# Altium project Project Board Test SOM AM625.PrjPcb (part 4 of 7)

## Sheet GBE1 PHY.SchDoc
size A2; DocumentNumber: 6; SheetNumber: 6; SheetTotal: 12
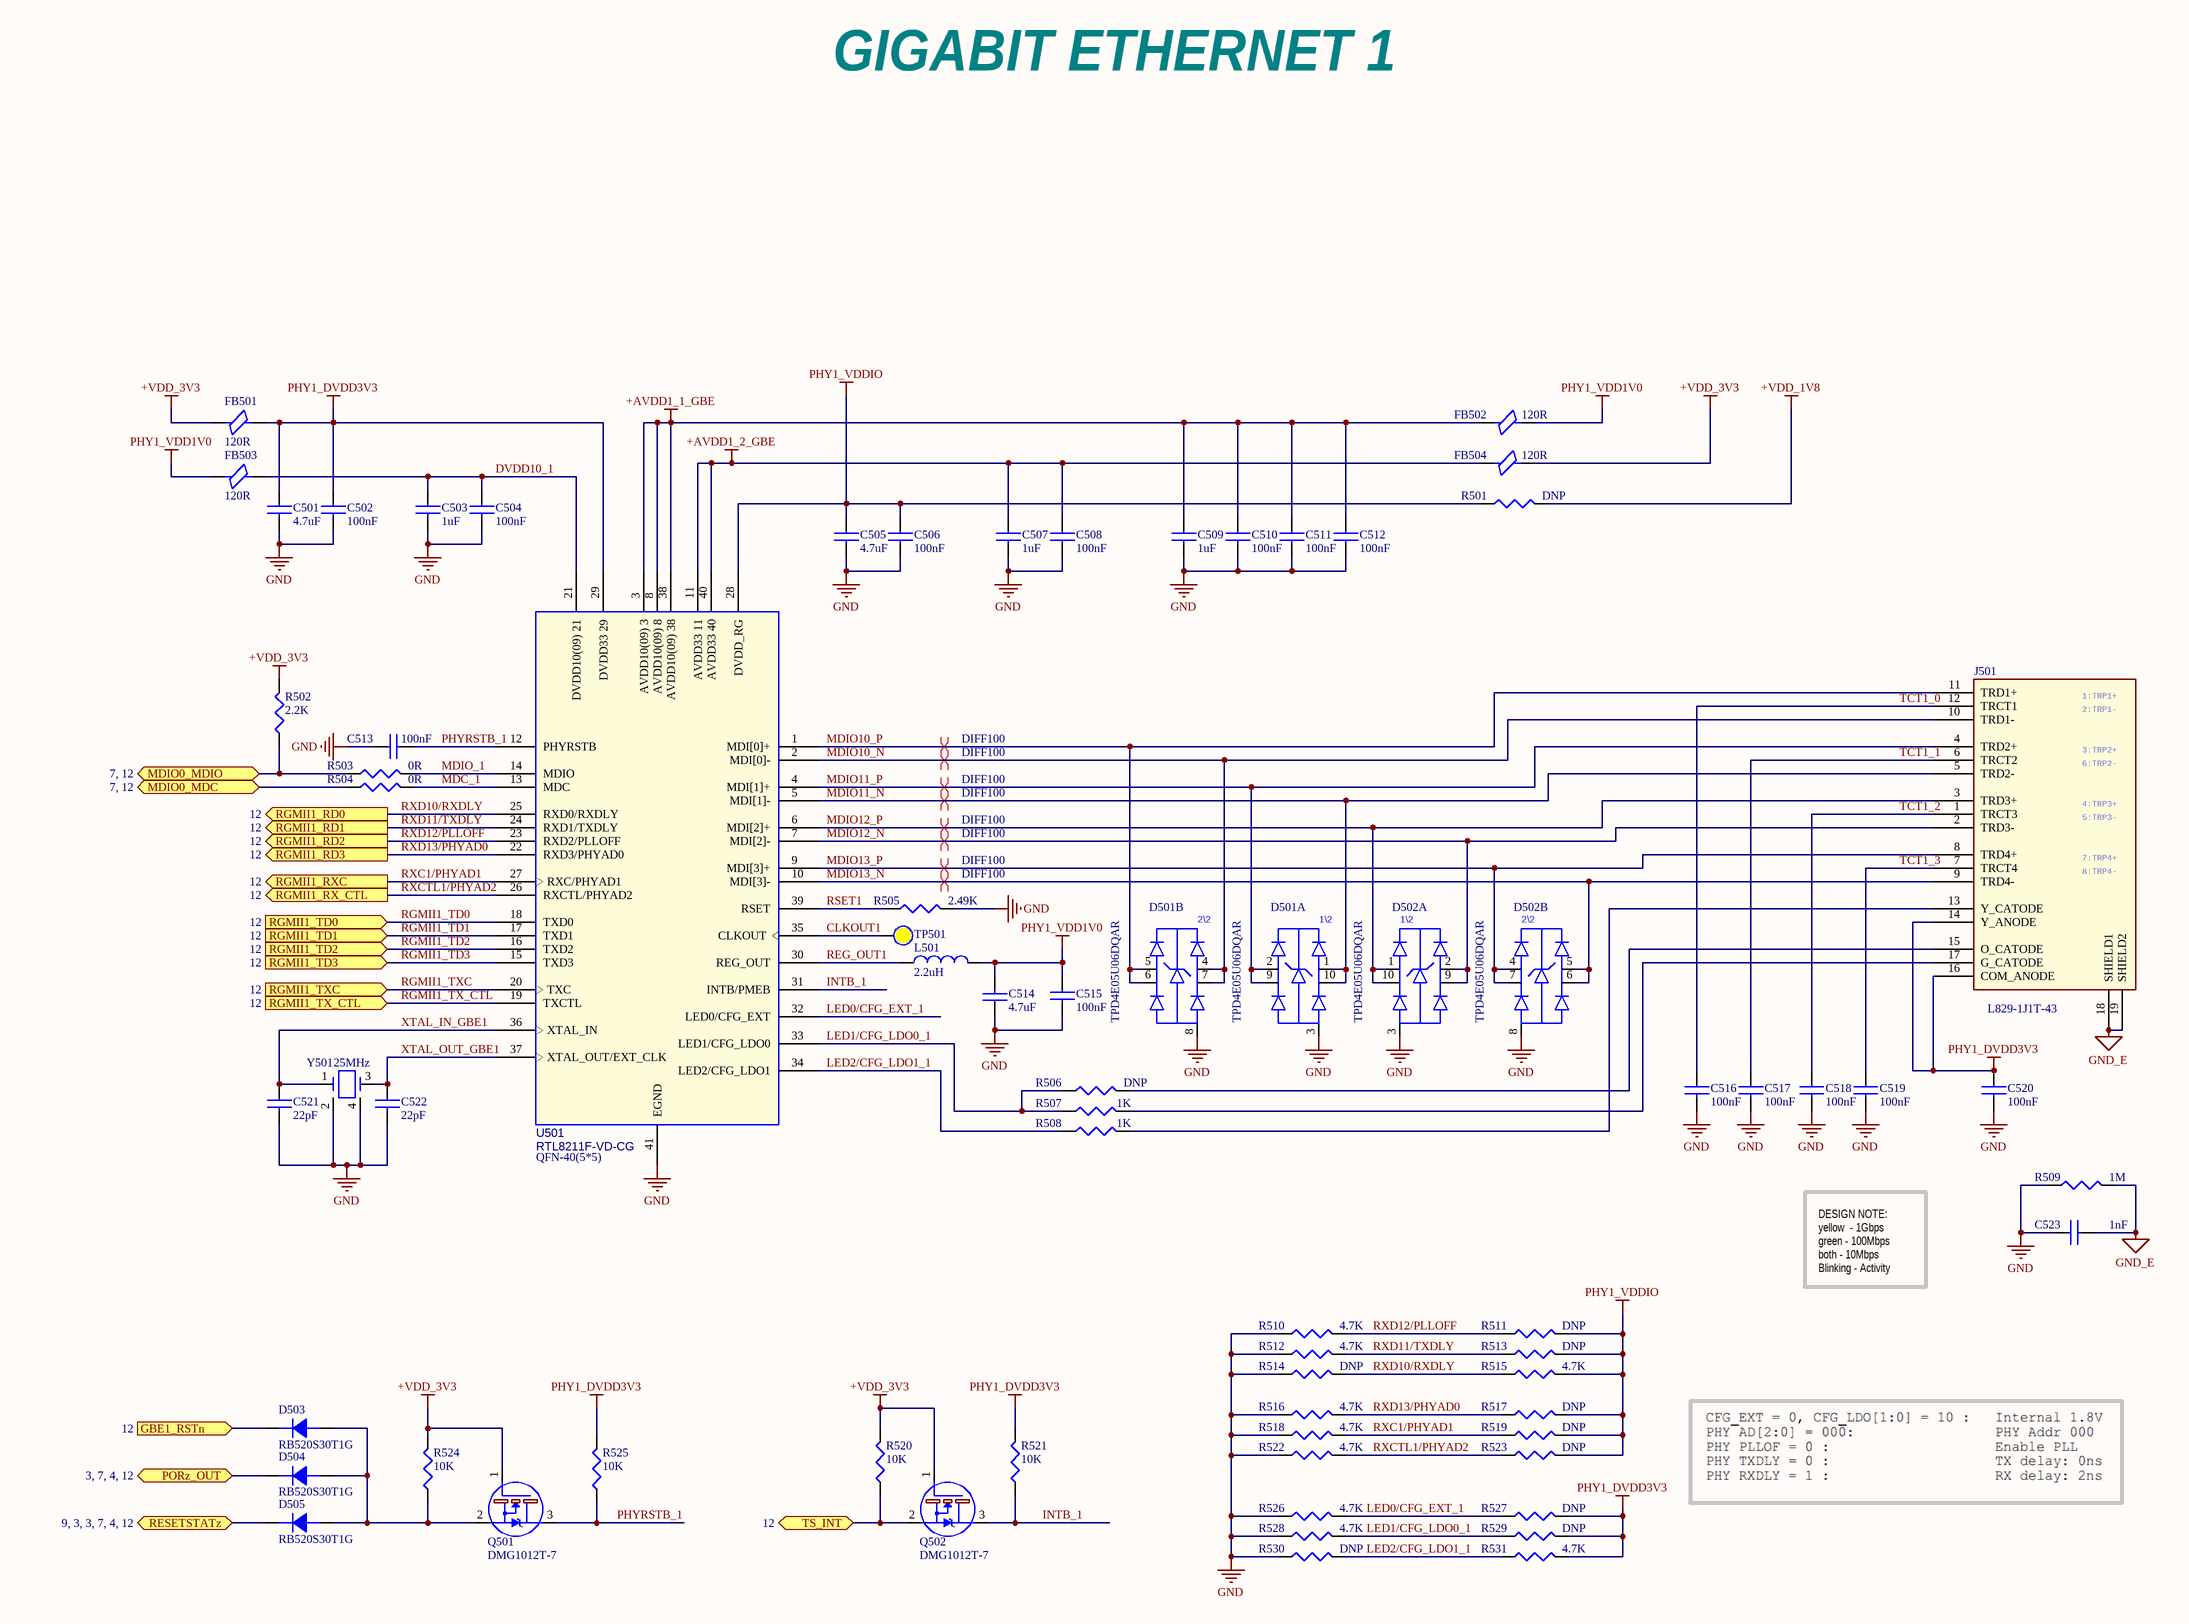
[diagram p3: GBE1 PHY.SchDoc]

### Parts
C501  4.7uF  [C0402]
C502  100nF  [C0201]
C503  1uF  [C0201]
C504  100nF  [C0201]
C505  4.7uF  [C0402]
C506  100nF  [C0201]
C507  1uF  [C0201]
C508  100nF  [C0201]
C509  1uF  [C0201]
C510  100nF  [C0201]
C511  100nF  [C0201]
C512  100nF  [C0201]
C513  100nF  [C0201]
C514  4.7uF  [C0402]
C515  100nF  [C0201]
C516  100nF  [C0402]
C517  100nF  [C0402]
C518  100nF  [C0402]
C519  100nF  [C0402]
C520  100nF  [C0402]
C521  22pF  [C0201]
C522  22pF  [C0201]
C523  1nF  [C1206B/3216MM]
D501  TPD4E05U06DQAR  [10-USON]  (parts A,B of 2)
D502  TPD4E05U06DQAR  [10-USON]  (parts A,B of 2)
D503  RB520S30T1G  [sod_523]
D504  RB520S30T1G  [sod_523]
D505  RB520S30T1G  [sod_523]
FB501  120R  [FB0402]
FB502  120R  [FB0402]
FB503  120R  [FB0402]
FB504  120R  [FB0402]
J501  L829-1J1T-43  [L829-1J1T-43]
L501  2.2uH  [l2016]
Q501  DMG1012T-7  [sot_523]
Q502  DMG1012T-7  [sot_523]
R501  DNP  [R0402]
R502  2.2K  [R0201]
R503  0R  [R0201]
R504  0R  [R0201]
R505  2.49K  [R0201]
R506  DNP  [R0402]
R507  1K  [R0402]
R508  1K  [R0402]
R509  1M  [R1206B/3216MM]
R510  4.7K  [R0201]
R511  DNP  [R0201]
R512  4.7K  [R0201]
R513  DNP  [R0201]
R514  DNP  [R0201]
R515  4.7K  [R0201]
R516  4.7K  [R0201]
R517  DNP  [R0201]
R518  4.7K  [R0201]
R519  DNP  [R0201]
R520  10K  [R0201]
R521  10K  [R0201]
R522  4.7K  [R0201]
R523  DNP  [R0201]
R524  10K  [R0201]
R525  10K  [R0201]
R526  4.7K  [R0201]
R527  DNP  [R0201]
R528  4.7K  [R0201]
R529  DNP  [R0201]
R530  DNP  [R0201]
R531  4.7K  [R0201]
TP501  (no value)  [Test Point 1 MM]  (no BOM)
U501  value RTL8211F-VD-CG  Package Size: QFN-40(5*5)  [qfn40_0D4_5x5mm]  (hidden comment: RTL8211)
Y501  25MHz  [x4-smd-3_2x2_5x1_0mm]

### Ports
GBE1_RSTn (in, see 12), MDIO0_MDC (bidir, see 7, 12), MDIO0_MDIO (bidir, see 7, 12), PORz_OUT (bidir, see 3, 7, 4, 12), RESETSTATz (bidir, see 9, 3, 3, 7, 4, 12), RGMII1_RD0 (out, see 12), RGMII1_RD1 (out, see 12), RGMII1_RD2 (out, see 12), RGMII1_RD3 (out, see 12), RGMII1_RX_CTL (out, see 12), RGMII1_RXC (out, see 12), RGMII1_TD0 (in, see 12), RGMII1_TD1 (in, see 12), RGMII1_TD2 (in, see 12), RGMII1_TD3 (in, see 12), RGMII1_TX_CTL (in, see 12), RGMII1_TXC (in, see 12), TS_INT (bidir, see 12)

### Nets
+AVDD1_1_GBE: C509.1 C510.1 C511.1 C512.1 FB502.1 U501.3(AVDD10(09)_3) U501.8(AVDD10(09)_8) U501.38(AVDD10(09)_38)
+AVDD1_2_GBE: C507.1 C508.1 FB504.1 U501.11(AVDD33_11) U501.40(AVDD33_40)
+VDD_1V8: R501.2
+VDD_3V3: FB501.1 FB504.2 Q501.1(G) Q502.1(G) R502.2 R520.2 R524.2
GND: C501.2 C502.2 C503.2 C504.2 C505.2 C506.2 C507.2 C508.2 C509.2 C510.2 C511.2 C512.2 C513.1 C514.1 C515.2 C516.2 C517.2 C518.2 C519.2 C520.2 C521.2 C522.2 C523.1 D501.3(GND1) D501.8(GND1) D502.3(GND1) D502.8(GND1) R505.2 R509.1 R510.1 R512.1 R514.1 R516.1 R518.1 R522.1 R526.1 R528.1 R530.1 U501.41(EGND) Y501.2(GND) Y501.4(GND)
GND_E: C523.2 J501.18(SHIELD1) J501.19(SHIELD2) R509.2
PHY1_DVDD3V3: C501.1 C502.1 C520.1 FB501.2 J501.14(Y_ANODE) J501.16(COM_ANODE) R521.2 R525.2 R527.2 R529.2 R531.2 U501.29(DVDD33_29)
PHY1_VDD1V0: C514.2 C515.1 FB502.2 FB503.1 L501.2
PHY1_VDDIO: C505.1 C506.1 R501.1 R511.2 R513.2 R515.2 R517.2 R519.2 R523.2 U501.28(DVDD_RG)
CLKOUT1: TP501.0 U501.35(CLKOUT)
DVDD10_1: C503.1 C504.1 FB503.2 U501.21(DVDD10(09)_21)
GBE1_RSTn: D503.2(C) ; port GBE1_RSTn
INTB_1: Q502.3(D) R521.1 U501.31(INTB/PMEB)
LED0/CFG_EXT_1: R526.2 R527.1 U501.32(LED0/CFG_EXT)
LED1/CFG_LDO0_1: R506.1 R507.1 R528.2 R529.1 U501.33(LED1/CFG_LDO0)
LED2/CFG_LDO1_1: R508.1 R530.2 R531.1 U501.34(LED2/CFG_LDO1)
MDC_1: R504.2 U501.13(MDC)
MDIO0_MDC: R504.1 ; port MDIO0_MDC
MDIO0_MDIO: R502.1 R503.1 ; port MDIO0_MDIO
MDIO10_N: D501.4(3A) D501.7(3B) J501.10(TRD1-) U501.2(MDI[0]-)
MDIO10_P: D501.5(4A) D501.6(4B) J501.11(TRD1+) U501.1(MDI[0]+)
MDIO11_N: D501.1(1A) D501.10(1B) J501.5(TRD2-) U501.5(MDI[1]-)
MDIO11_P: D501.2(2A) D501.9(2B) J501.4(TRD2+) U501.4(MDI[1]+)
MDIO12_N: D502.2(2A) D502.9(2B) J501.2(TRD3-) U501.7(MDI[2]-)
MDIO12_P: D502.1(1A) D502.10(1B) J501.3(TRD3+) U501.6(MDI[2]+)
MDIO13_N: D502.5(4A) D502.6(4B) J501.9(TRD4-) U501.10(MDI[3]-)
MDIO13_P: D502.4(3A) D502.7(3B) J501.8(TRD4+) U501.9(MDI[3]+)
MDIO_1: R503.2 U501.14(MDIO)
PHYRSTB_1: C513.2 Q501.3(D) R525.1 U501.12(PHYRSTB)
PORz_OUT: D504.2(C) ; port PORz_OUT
REG_OUT1: L501.1 U501.30(REG_OUT)
RESETSTATz: D505.2(C) ; port RESETSTATz
RGMII1_TD0: U501.18(TXD0) ; port RGMII1_TD0
RGMII1_TD1: U501.17(TXD1) ; port RGMII1_TD1
RGMII1_TD2: U501.16(TXD2) ; port RGMII1_TD2
RGMII1_TD3: U501.15(TXD3) ; port RGMII1_TD3
RGMII1_TX_CTL: U501.19(TXCTL) ; port RGMII1_TX_CTL
RGMII1_TXC: U501.20(TXC) ; port RGMII1_TXC
RSET1: R505.1 U501.39(RSET)
RXC1/PHYAD1: R518.2 R519.1 U501.27(RXC/PHYAD1) ; port RGMII1_RXC
RXCTL1/PHYAD2: R522.2 R523.1 U501.26(RXCTL/PHYAD2) ; port RGMII1_RX_CTL
RXD10/RXDLY: R514.2 R515.1 U501.25(RXD0/RXDLY) ; port RGMII1_RD0
RXD11/TXDLY: R512.2 R513.1 U501.24(RXD1/TXDLY) ; port RGMII1_RD1
RXD12/PLLOFF: R510.2 R511.1 U501.23(RXD2/PLLOFF) ; port RGMII1_RD2
RXD13/PHYAD0: R516.2 R517.1 U501.22(RXD3/PHYAD0) ; port RGMII1_RD3
TCT1_0: C516.1 J501.12(TRCT1)
TCT1_1: C517.1 J501.6(TRCT2)
TCT1_2: C518.1 J501.1(TRCT3)
TCT1_3: C519.1 J501.7(TRCT4)
TS_INT: Q502.2(S) R520.1 ; port TS_INT
XTAL_IN_GBE1: C521.1 U501.36(XTAL_IN) Y501.1
XTAL_OUT_GBE1: C522.1 U501.37(XTAL_OUT/EXT_CLK) Y501.3
NetD503_1: D503.1(A) D504.1(A) D505.1(A) Q501.2(S) R524.1
NetJ501_13: J501.13(Y_CATODE) R508.2
NetJ501_15: J501.15(O_CATODE) R506.2
NetJ501_17: J501.17(G_CATODE) R507.2

### Layout directives
differential pair; net class DIFF100: MDIO10_N, MDIO10_P, MDIO11_N, MDIO11_P, MDIO12_N, MDIO12_P, MDIO13_N, MDIO13_P

### Notes on the sheet
- GIGABIT ETHERNET 1
- DESIGN NOTE:
  yellow  - 1Gbps
  green - 100Mbps
  both - 10Mbps
  Blinking - Activity
- (in symbol L829-1J1T-43) 1:TRP1+; 2:TRP1-; 3:TRP2+; 6:TRP2-; 4:TRP3+; 5:TRP3-; 7:TRP4+; 8:TRP4-
- (in symbol TPD4E05U06DQAR, part A) 1\2
- (in symbol TPD4E05U06DQAR, part B) 2\2

### Library data of the parts
C501 C505 C514 = CC0402MRX5R5BB475: Multilayer Ceramic Capacitor, 4.7 uF, 6.3V, ± 10%, X5R, 0402 [1005 Metric]; Manufacturer: Yageo; Material: 4241ConductorMaterial; Temperature Coefficient: 30ppm/°C; Supplier 1: Future Electronics; Manufacturer Part Number: CC0402MRX5R5BB475; RoHS: Yes; Category: Ceramic Capacitors; Stock 1: 240000; Pricing 1: 10000=0.0195, 20000=0.019, 40000=0.0186, 50000=0.0185, 150000=0.0176 (USD); ComponentLink1URL: http://www.mouser.com/ds/2/447/UPY-GPHC_X5R_4V-to-50V_25-1131599.pdf?src-supplier=Mouser; ComponentLink1Description: http://www.mouser.com/ds/2/447/UPY-GPHC_X5R_4V-to-50V_25-1131599.pdf?src-supplier=Mouser; ComponentLink2URL: https://datasheet.octopart.com/CC0402MRX5R5BB475-Yageo-datasheet-140260304.pdf?src-supplier=Newark; ComponentLink2Description: https://datasheet.octopart.com/CC0402MRX5R5BB475-Yageo-datasheet-140260304.pdf?src-supplier=Newark; ComponentLink3URL: https://datasheet.octopart.com/CC0402MRX5R5BB475-Yageo-datasheet-137875056.pdf?src-supplier=Future+Electronics; ComponentLink3Description: https://datasheet.octopart.com/CC0402MRX5R5BB475-Yageo-datasheet-137875056.pdf?src-supplier=Future+Electronics; ComponentLink4URL: http://www.yageo.com/documents/recent/UPY-GPHC_X5R_4V-to-50V_25.pdf?src-supplier=Digi-Key; ComponentLink4Description: http://www.yageo.com/documents/recent/UPY-GPHC_X5R_4V-to-50V_25.pdf?src-supplier=Digi-Key; ComponentLink5URL: http://www.yageo.com/exep/pages/download/literatures/ProductSelectionGuide%202014_Final_2.pdf?src-supplier=Digi-Key; ComponentLink5Description: http://www.yageo.com/exep/pages/download/literatures/ProductSelectionGuide%202014_Final_2.pdf?src-supplier=Digi-Key; ComponentLink6URL: http://www.yageo.com/documents/recent/UPY-GPHC_X5R_4V-to-50V_12.pdf?src-supplier=Avnet; ComponentLink6Description: http://www.yageo.com/documents/recent/UPY-GPHC_X5R_4V-to-50V_12.pdf?src-supplier=Avnet; ComponentLink7URL: https://datasheet.octopart.com/CC0402MRX5R5BB475-Yageo-datasheet-149070021.pdf?src-supplier=TME; ComponentLink7Description: https://datasheet.octopart.com/CC0402MRX5R5BB475-Yageo-datasheet-149070021.pdf?src-supplier=TME; Supplier Part Number 1: 7044477
C502 C504 C506 C508 C510-C513 C515 = CC0201KRX5R6BB104: Multilayer Ceramic Capacitor, 0.1 uF, 16 V, ± 10%, X5R, 0201 [0603 Metric]; Manufacturer: Yageo; Material: 4241ConductorMaterial; Voltage Rating (DC): 10V; Supplier 1: Future Electronics; Manufacturer Part Number: CC0201KRX5R6BB104; RoHS: Yes; Category: Ceramic Capacitors; Stock 1: 10410000; Pricing 1: 15000=0.0027, 60000=0.0026, 150000=0.0025, 375000=0.0024, 600000=0.0023 (USD); Mount: Surface Mount; Case/Package: 0201; Case Code (Imperial): 0201; Case Code (Metric): 0603; Weight: 6E-06oz; Min Operating Temperature: -55°C; Max Operating Temperature: 85°C; Capacitance: 100nF; Tolerance: 10%; Dielectric: X5R; Packaging: Tape and Reel; Termination: SMD/SMT; Voltage Rating: 10V; Series: CC; Construction: Flat; Length: 0.6mm; Height: 0.3mm; Depth: 0.3mm; Radiation Hardening: No; RoHS Compliant: Yes; Halogen Free: 5694HalogenFree; Lead Free: 5697LeadFree; ComponentLink1URL: https://datasheet.ciiva.com/11587/upy-gphc-x5r-4v-to-50v-12-11587190.pdf?src-supplier=Avnet; ComponentLink1Description: https://datasheet.ciiva.com/11587/upy-gphc-x5r-4v-to-50v-12-11587190.pdf?src-supplier=Avnet; Supplier Part Number 1: 5050553
C503 C507 C509 = CC0201MRX5R5BB105: 1 µF ±20% 6.3V Ceramic Capacitor X5R 0201 (0603 Metric); Manufacturer: Yageo; Material: 4241ConductorMaterial; Supplier 1: Arrow Electronics; Manufacturer Part Number: CC0201MRX5R5BB105; RoHS: Yes; Category: Ceramic Capacitors; Stock 1: 4273; Pricing 1: 1=0.0528, 10=0.0235, 25=0.0164, 100=0.0113, 250=0.0112, 500=0.0095, 1000=0.0081, 3000=0.0066 (USD); Mount: Surface Mount; Case/Package: 0201; Case Code (Imperial): 0201; Case Code (Metric): 0603; Weight: 6E-06oz; Min Operating Temperature: -55°C; Max Operating Temperature: 85°C; Capacitance: 1uF; Voltage Rating (DC): 6.3V; Tolerance: 20%; Packaging: Tape and Reel; Dielectric: X5R; Voltage Rating: 6.3V; Termination: SMD/SMT; Series: CC; Height: 330um; Lead Free: Lead Free; Halogen Free: Halogen Free; RoHS Compliant: Yes; ComponentLink1URL: http://www.mouser.com/ds/2/447/UPY-GPHC_X5R_4V-to-50V_25-1131599.pdf?src-supplier=Mouser; ComponentLink1Description: http://www.mouser.com/ds/2/447/UPY-GPHC_X5R_4V-to-50V_25-1131599.pdf?src-supplier=Mouser; ComponentLink2URL: http://www.yageo.com/documents/recent/UPY-GPHC_X5R_4V-to-50V_25.pdf?src-supplier=Digi-Key; ComponentLink2Description: http://www.yageo.com/documents/recent/UPY-GPHC_X5R_4V-to-50V_25.pdf?src-supplier=Digi-Key; ComponentLink3URL: https://datasheet.octopart.com/CC0201MRX5R5BB105-Yageo-datasheet-140260304.pdf?src-supplier=Newark; ComponentLink3Description: https://datasheet.octopart.com/CC0201MRX5R5BB105-Yageo-datasheet-140260304.pdf?src-supplier=Newark; ComponentLink4URL: https://datasheet.octopart.com/CC0201MRX5R5BB105-Yageo-datasheet-170350636.pdf?src-supplier=Future+Electronics; ComponentLink4Description: https://datasheet.octopart.com/CC0201MRX5R5BB105-Yageo-datasheet-170350636.pdf?src-supplier=Future+Electronics; ComponentLink5URL: https://www.yageo.com/upload/media/product/productsearch/datasheet/mlcc/UPY-GPHC_X5R_4V-to-50V_26.pdf?src-supplier=Digi-Key; ComponentLink5Description: https://www.yageo.com/upload/media/product/productsearch/datasheet/mlcc/UPY-GPHC_X5R_4V-to-50V_26.pdf?src-supplier=Digi-Key; ComponentLink6URL: http://www.yageo.com/exep/pages/download/literatures/ProductSelectionGuide%202014_Final_2.pdf?src-supplier=Digi-Key; ComponentLink6Description: http://www.yageo.com/exep/pages/download/literatures/ProductSelectionGuide%202014_Final_2.pdf?src-supplier=Digi-Key; Supplier Part Number 1: CC0201MRX5R5BB105
C516-C520 = C1005X5R1H104K050BB: Multilayer Ceramic Capacitor, 0.1 uF, 50 V, ± 10%, X5R, 0402 [1005 Metric]; Manufacturer: TDK; Voltage Rating: 50V; Supplier 1: Digi-Key; Manufacturer Part Number: C1005X5R1H104K050BB; RoHS: Yes; Category: Ceramic Capacitors; Stock 1: 1455249; Pricing 1: 1=0.11, 10=0.076, 50=0.0438, 100=0.034, 500=0.0256, 1000=0.02011, 2500=0.01828, 5000=0.01682 (USD); Mount: Surface Mount; Case/Package: 0402; Case Code (Metric): 1005; Case Code (Imperial): 0402; Min Operating Temperature: -55°C; Max Operating Temperature: 85°C; Capacitance: 100nF; Tolerance: 10%; Packaging: Tape and Reel; Dielectric: X5R; Construction: Flat; Voltage: 50V; Series: C; Length: 1mm; Height: 0.5mm; Depth: 0.5mm; Radiation Hardening: No; RoHS Compliant: Yes; Reach SVHC Compliant: Unknown; ComponentLink1URL: https://datasheet.ciiva.com/26946/getdatasheetpartid-743571-26946503.pdf?src-supplier=Verical; ComponentLink1Description: https://datasheet.ciiva.com/26946/getdatasheetpartid-743571-26946503.pdf?src-supplier=Verical; ComponentLink2URL: https://datasheet.ciiva.com/16494/e413-c-16494264.pdf?src-supplier=Future+Electronics; ComponentLink2Description: https://datasheet.ciiva.com/16494/e413-c-16494264.pdf?src-supplier=Future+Electronics; ComponentLink3URL: https://datasheet.ciiva.com/6292/tdkmlcccaprange-6292486.pdf?src-supplier=Digi-Key; ComponentLink3Description: https://datasheet.ciiva.com/6292/tdkmlcccaprange-6292486.pdf?src-supplier=Digi-Key; Supplier Part Number 1: 445-5942-1-ND
C521 C522 = CC0201JRNPO9BN220: 0201 22 pF 50 V ±5 % Tolerance NP0 SMT Multilayer Ceramic Capacitor; Manufacturer: Yageo; Supplier 1: Future Electronics; Manufacturer Part Number: CC0201JRNPO9BN220; RoHS: Yes; Category: Ceramic Capacitors; Stock 1: 2130000; Pricing 1: 15000=0.0012, 60000=0.0011, 225000=0.0011, 600000=0.001, 1500000=0.001 (USD); Halogen Free: 5694HalogenFree; ComponentLink1URL: https://datasheet.ciiva.com/22653/1443161-22653023.pdf?src-supplier=Farnell; ComponentLink1Description: https://datasheet.ciiva.com/22653/1443161-22653023.pdf?src-supplier=Farnell; ComponentLink2URL: https://datasheet.ciiva.com/7661/1443161-7661754.pdf?src-supplier=Element14; ComponentLink2Description: https://datasheet.ciiva.com/7661/1443161-7661754.pdf?src-supplier=Element14; ComponentLink3URL: https://datasheet.ciiva.com/176/mlccorderingcode-176669.pdf?src-supplier=Digi-Key; ComponentLink3Description: https://datasheet.ciiva.com/176/mlccorderingcode-176669.pdf?src-supplier=Digi-Key; ComponentLink4URL: https://datasheet.ciiva.com/176/mlccorderingcode-176670.pdf?src-supplier=Digi-Key; ComponentLink4Description: https://datasheet.ciiva.com/176/mlccorderingcode-176670.pdf?src-supplier=Digi-Key; ComponentLink5URL: https://datasheet.ciiva.com/176/mlccorderingcode-176671.pdf?src-supplier=Digi-Key; ComponentLink5Description: https://datasheet.ciiva.com/176/mlccorderingcode-176671.pdf?src-supplier=Digi-Key; ComponentLink6URL: https://datasheet.ciiva.com/16743/upy-gp-np0-16v-to-50v-8-16743595.pdf?src-supplier=Future+Electronics; ComponentLink6Description: https://datasheet.ciiva.com/16743/upy-gp-np0-16v-to-50v-8-16743595.pdf?src-supplier=Future+Electronics; Supplier Part Number 1: 2014702
C523 = C1206C102KDRACAUTO: Cap Ceramic 0.001uF 1000V X7R 10% Pad SMD 1206 125°C Low ESR Automotive Medical T/R; Manufacturer: KEMET; Dielectric Material: 4241ConductorMaterial; Supplier 1: Mouser; Manufacturer Part Number: C1206C102KDRACAUTO; RoHS: Yes; Category: Ceramic Capacitors; Stock 1: 30132; Pricing 1: 1=0.29, 10=0.122, 50=0.122, 100=0.076, 1000=0.07, 10000=0.061 (USD); ComponentLink1URL: http://www.mouser.com/ds/2/212/KEM_C1010_X7R_HV_SMD-345925.pdf?src-supplier=Mouser; ComponentLink1Description: http://www.mouser.com/ds/2/212/KEM_C1010_X7R_HV_SMD-345925.pdf?src-supplier=Mouser; ComponentLink2URL: https://api.kemet.com/component-edge/download/datasheet/C1206C102KDRACAUTO.pdf?src-supplier=Digi-Key; ComponentLink2Description: https://api.kemet.com/component-edge/download/datasheet/C1206C102KDRACAUTO.pdf?src-supplier=Digi-Key; ComponentLink3URL: https://api.kemet.com/component-edge/download/specsheet/C1206C102KDRACAUTO.pdf?src-supplier=Digi-Key; ComponentLink3Description: https://api.kemet.com/component-edge/download/specsheet/C1206C102KDRACAUTO.pdf?src-supplier=Digi-Key; ComponentLink4URL: http://www.farnell.com/datasheets/2747389.pdf?src-supplier=Newark; ComponentLink4Description: http://www.farnell.com/datasheets/2747389.pdf?src-supplier=Newark; ComponentLink5URL: https://datasheet.octopart.com/C1206C102KDRACAUTO-KEMET-datasheet-149525139.pdf?src-supplier=Farnell; ComponentLink5Description: https://datasheet.octopart.com/C1206C102KDRACAUTO-KEMET-datasheet-149525139.pdf?src-supplier=Farnell; Supplier Part Number 1: 80-C1206C102KDRAUTO
D501 D502 = TPD4E05U06DQAR: Quad 0.5-pF, 5.5-V, ±12-kV ESD protection diode for USB, HDMI & High Speed Interfaces; Manufacturer: Texas Instruments; Direction: Unidirectional; Working Voltage: 5.5V; Min Breakdown Voltage: 6V; Clamping Voltage: 14V; Peak Pulse Power: 40W; Power Line Protection: Yes; Number of Channels: 4; Leakage Current: 10nA; Peak Pulse Current: 2.5A; Interface: LVDS,USB,Ethernet,HDMI,PCIe,SATA; Supplier 1: Mouser; Manufacturer Part Number: TPD4E05U06DQAR; RoHS: Yes; Category: Integrated Circuits (ICs); Stock 1: 35141; Pricing 1: 1=0.58, 10=0.487, 50=0.487, 100=0.339, 500=0.264, 1000=0.216, 3000=0.189, 9000=0.167, 10000=0.167, 24000=0.163, 45000=0.161 (USD); Mount: Surface Mount; Case/Package: SON; Number of Pins: 10; Min Operating Temperature: -40°C; Max Operating Temperature: 125°C; Packaging: Tape and Reel; Package Quantity: 3000; Polarity: Unidirectional; Reverse Standoff Voltage: 5.5V; Breakdown Voltage: 6V; Max Power Dissipation: 40W; Termination: SMD/SMT; Operating Supply Voltage: 5.5V; Series: -; Number of Unidirectional Channels: 4; Length: 2.6mm; Depth: 1.1mm; Radiation Hardening: No; Reach SVHC Compliant: No; Lead Free: Lead Free; RoHS Compliant: Yes; ComponentLink1URL: https://datasheet.ciiva.com/15063/tpd4e05u06-15063653.pdf?src-supplier=Digi-Key; ComponentLink1Description: https://datasheet.ciiva.com/15063/tpd4e05u06-15063653.pdf?src-supplier=Digi-Key; ComponentLink2URL: https://datasheet.ciiva.com/24119/slvsbo7f-316827-24119436.pdf?src-supplier=Mouser; ComponentLink2Description: https://datasheet.ciiva.com/24119/slvsbo7f-316827-24119436.pdf?src-supplier=Mouser; ComponentLink3URL: https://datasheet.ciiva.com/26918/getdatasheetpartid-716763-26918024.pdf?src-supplier=Verical; ComponentLink3Description: https://datasheet.ciiva.com/26918/getdatasheetpartid-716763-26918024.pdf?src-supplier=Verical; ComponentLink4URL: https://datasheet.ciiva.com/15063/tpd4e05u06-15063654.pdf?src-supplier=Digi-Key; ComponentLink4Description: https://datasheet.ciiva.com/15063/tpd4e05u06-15063654.pdf?src-supplier=Digi-Key; ComponentLink5URL: https://datasheet.ciiva.com/15063/tpd4e05u06-15063655.pdf?src-supplier=Digi-Key; ComponentLink5Description: https://datasheet.ciiva.com/15063/tpd4e05u06-15063655.pdf?src-supplier=Digi-Key; ComponentLink6URL: https://datasheet.ciiva.com/29883/tpd4e05u06-29883798.pdf?src-supplier=Avnet; ComponentLink6Description: https://datasheet.ciiva.com/29883/tpd4e05u06-29883798.pdf?src-supplier=Avnet; Supplier Part Number 1: 595-TPD4E05U06DQAR
D503-D505 = RB520S30T1G: Diode Schottky 30V 0.2A 2-Pin SOD-523 T/R - Product that comes on tape, but is not reeled; Manufacturer: ON Semiconductor; Polarity: Standard; Current Rating: 200mA; Element Configuration: Single; Forward Voltage: 600mV; Max Reverse Leakage Current: 1uA; Power Dissipation: 200mW; Supplier 1: Future Electronics; Manufacturer Part Number: RB520S30T1G; RoHS: Yes; Category: Schottky Diodes; Stock 1: 33000; Pricing 1: 3000=0.0155, 12000=0.0148, 45000=0.0143, 90000=0.0139, 225000=0.0133 (USD); Case/Package: SOD-523-2; Number of Pins: 2; Min Operating Temperature: -55°C; Max Operating Temperature: 150°C; Packaging: Tape and Reel; Voltage Rating (DC): 30V; Output Current: 200mA; Max Repetitive Reverse Voltage (Vrrm): 30V; Package Quantity: 3000; Forward Current: 200mA; Average Rectified Current: 200mA; Max Forward Surge Current (Ifsm): 200mA; Max Reverse Current: 1uA; Max Reverse Voltage (DC): 30V; Series: -; Length: 1.3mm; Width: 0.9mm; Height: 0.7mm; Radiation Hardening: No; Reach SVHC Compliant: No; Lead Free: Lead Free; RoHS Compliant: Yes; ComponentLink1URL: https://datasheet.ciiva.com/915/rb520s30t1-d-915377.pdf?src-supplier=Avnet; ComponentLink1Description: https://datasheet.ciiva.com/915/rb520s30t1-d-915377.pdf?src-supplier=Avnet; ComponentLink2URL: https://datasheet.ciiva.com/915/rb520s30t1-d-915377.pdf?src-supplier=Digi-Key; ComponentLink2Description: https://datasheet.ciiva.com/915/rb520s30t1-d-915377.pdf?src-supplier=Digi-Key; ComponentLink3URL: https://datasheet.ciiva.com/22659/1708342-22659126.pdf?src-supplier=Element14; ComponentLink3Description: https://datasheet.ciiva.com/22659/1708342-22659126.pdf?src-supplier=Element14; ComponentLink4URL: https://datasheet.ciiva.com/4715/rb520s30t1-d-101117-4715113.pdf?src-supplier=Mouser; ComponentLink4Description: https://datasheet.ciiva.com/4715/rb520s30t1-d-101117-4715113.pdf?src-supplier=Mouser; ComponentLink5URL: https://datasheet.ciiva.com/16210/rb520s30t1-d-16210917.pdf?src-supplier=Future+Electronics; ComponentLink5Description: https://datasheet.ciiva.com/16210/rb520s30t1-d-16210917.pdf?src-supplier=Future+Electronics; ComponentLink6URL: https://datasheet.ciiva.com/8292/rb520s30t1-d-8292399.pdf?src-supplier=Avnet; ComponentLink6Description: https://datasheet.ciiva.com/8292/rb520s30t1-d-8292399.pdf?src-supplier=Avnet; ComponentLink7URL: https://datasheet.ciiva.com/915/rb520s30t1-d-915378.pdf?src-supplier=Digi-Key; ComponentLink7Description: https://datasheet.ciiva.com/915/rb520s30t1-d-915378.pdf?src-supplier=Digi-Key; ComponentLink8URL: https://datasheet.ciiva.com/915/rb520s30t1-d-915379.pdf?src-supplier=Digi-Key; ComponentLink8Description: https://datasheet.ciiva.com/915/rb520s30t1-d-915379.pdf?src-supplier=Digi-Key; Supplier Part Number 1: 7657109
FB501-FB504 = BLM15PD121SZ1D: Ferrite Beads Multi-Layer 120Ohm 25% 100MHz 1.3A 0.09Ohm DCR 0402 Automotive T/R; Manufacturer: Murata; Core Material: 228ConductorMaterial; Number of Lines: 1; Resistance: 90mR; Supplier 1: Arrow Electronics; Manufacturer Part Number: BLM15PD121SZ1D; RoHS: Yes; Category: Ferrite Beads and Chips; Stock 1: 10000; Pricing 1: 10000=0.0178, 20000=0.0168, 30000=0.016, 50000=0.0158 (USD); Mount: Surface Mount; Case/Package: 0402; Case Code (Imperial): 0402; Case Code (Metric): 1005; Min Operating Temperature: -55°C; Max Operating Temperature: 125°C; Packaging: Cut Tape; Max Current Rating: 1.3A; Series: EMIFIL®, BLM15; RMS Current (Irms): 1.3A; Series Resistance: 90mR; Test Frequency: 100MHz; Tolerance: 25%; Height: 550um; Ratings: AEC-Q200; RoHS Compliant: Yes; ComponentLink1URL: https://www.murata.com/en-us/products/productdata/8796748677150/QNFA9118.pdf?src-supplier=Digi-Key; ComponentLink1Description: https://www.murata.com/en-us/products/productdata/8796748677150/QNFA9118.pdf?src-supplier=Digi-Key; Supplier Part Number 1: BLM15PD121SZ1D
J501 = L829-1J1T-43: CONN MAGJACK 1PORT SHLD 1000BT; Manufacturer: Bel Fuse Inc; Connector Type: RJ45; Number of Ports: 1; Speed: 10/100/1000 Base-T; LED Color: Green, Orange - Yellow; Number of Cores per Jack: 8; Shielding: Shielded; Tab Direction: Up; .Checked PCB: RF; Supplier 1: Digi-Key; Manufacturer Part Number: L829-1J1T-43; RoHS: RoHS Compliant; Category: Connectors, Interconnects; Stock 1: 7172; Pricing 1: 1=4.67, 10=3.863, 100=2.8974, 250=2.672, 500=2.41446, 1000=2.14082, 2500=2.05229, 5000=2.01205 (GBP); Number of Rows: 1; Mounting Type: Panel Mount; Through Hole, Right Angle; Height Above Board: 0.445" (11.30mm); Features: AutoMDIX, Board Guide; Packaging: Tray; ComponentLink1URL: http://www.belfuse.com/Data/Datasheets/L829-1J1T-43.pdf; ComponentLink1Description: http://www.belfuse.com/Data/Datasheets/L829-1J1T-43.pdf; Supplier Part Number 1: 380-1110-ND; .Checked SCH: RF
L501 = DFE201610P-2R2M=P2: Inductor Power Shielded Wirewound 2.2uH 20% 1MHz Metal 1.4A 0.168Ohm DCR 0806 T/R; Manufacturer: Murata; Core Material: Ferrite; Current Rating: 2A; DC Resistance (DCR): 168mR; Supplier 1: Arrow Electronics; Manufacturer Part Number: DFE201610P-2R2M=P2; RoHS: Yes; Category: Fixed Inductors; Stock 1: 1; Pricing 1: 1=0.1096 (USD); Mount: Surface Mount; Case/Package: 0806; Case Code (Metric): 2016; Case Code (Imperial): 0806; Min Operating Temperature: -40°C; Max Operating Temperature: 125°C; Inductance: 2.2uH; Packaging: Cut Tape; Shielding: Shielded; Test Frequency: 1MHz; Tolerance: 20%; Series: DFE201610P; Length: 0.079inch; Width: 0.063inch; Height - Seated (Max): 0.039inch; RoHS Compliant: Yes; ComponentLink1URL: http://farnell.com//datasheets/2550119.pdf?src-supplier=Farnell; ComponentLink1Description: http://farnell.com//datasheets/2550119.pdf?src-supplier=Farnell; ComponentLink2URL: https://www.murata.com/~/media/webrenewal/products/inductor/chip/tokoproducts/wirewoundmetalalloychiptype/m_dfe201610p.ashx?src-supplier=Digi-Key; ComponentLink2Description: https://www.murata.com/~/media/webrenewal/products/inductor/chip/tokoproducts/wirewoundmetalalloychiptype/m_dfe201610p.ashx?src-supplier=Digi-Key; Supplier Part Number 1: DFE201610P-2R2M=P2
Q501 Q502 = DMG1012T-7: Transistor MOSFET NTR4003NT1G, SOT23, ON Semi; Manufacturer: Diodes; Rise Time: 7.4ns; Continuous Drain Current (ID): 630mA; Fall Time: 12.3ns; Turn-On Delay Time: 5.1ns; Turn-Off Delay Time: 26.7ns; Gate to Source Voltage (Vgs): 6V; Rds On Max: 400mR; Input Capacitance: 60.67pF; Max Power Dissipation: 280mW; Number of Elements: 1; Drain to Source Voltage (Vdss): 20V; Drain to Source Resistance: 300mR; Threshold Voltage: 1V; FET Type: 1 N-Channel; Polarity: N-CHANNEL; Supplier 1: Future Electronics; Manufacturer Part Number: DMG1012T-7; RoHS: Yes; Category: MOSFETs; Stock 1: 2052000; Pricing 1: 3000=0.0322, 9000=0.0311, 30000=0.0299, 60000=0.0292, 120000=0.0279 (USD); Mount: Surface Mount; Case/Package: SOT-523; Number of Pins: 3; Weight: 7.1E-05oz; Min Operating Temperature: -55°C; Max Operating Temperature: 150°C; Package Quantity: 3000; Packaging: Tape and Reel; Number of Channels: 1; Power Dissipation: 280mW; Series: -; Drain-source On Resistance-Max: 400MR; Length: 1.7mm; Width: 0.85mm; Height: 0.8mm; Radiation Hardening: No; Reach SVHC Compliant: No; Lead Free: Lead Free; RoHS Compliant: Yes; ComponentLink1URL: https://datasheet.ciiva.com/934/ds31783-934512.pdf?src-supplier=Digi-Key; ComponentLink1Description: https://datasheet.ciiva.com/934/ds31783-934512.pdf?src-supplier=Digi-Key; ComponentLink2URL: https://datasheet.ciiva.com/4442/ds31783-44973-4442944.pdf?src-supplier=Mouser; ComponentLink2Description: https://datasheet.ciiva.com/4442/ds31783-44973-4442944.pdf?src-supplier=Mouser; ComponentLink3URL: https://datasheet.ciiva.com/11174/ds31783-11174965.pdf?src-supplier=Avnet; ComponentLink3Description: https://datasheet.ciiva.com/11174/ds31783-11174965.pdf?src-supplier=Avnet; ComponentLink4URL: https://datasheet.ciiva.com/934/ds31783-934511.pdf?src-supplier=Digi-Key; ComponentLink4Description: https://datasheet.ciiva.com/934/ds31783-934511.pdf?src-supplier=Digi-Key; ComponentLink5URL: https://datasheet.ciiva.com/6383/ds31783-6383803.pdf?src-supplier=Digi-Key; ComponentLink5Description: https://datasheet.ciiva.com/6383/ds31783-6383803.pdf?src-supplier=Digi-Key; Supplier Part Number 1: 1018280
R501 R506 = RC0402JR-070RL: Zero Ohm Resistor, Jumper, 0402 [1005 Metric], Thick Film, 63 mW, 1 A, Surface Mount; Manufacturer: Yageo; Resistance: 0mR; Power Rating: 62.5mW; Tolerance: 5%; Voltage Rating: 50V; Max Power Dissipation: 63mW; Temperature Coefficient: 200ppm/°C; Supplier 1: Future Electronics; Manufacturer Part Number: RC0402JR-070RL; RoHS: Yes; Category: Chip SMD Resistors; Stock 1: 51030000; Pricing 1: 10000=0.0009, 50000=0.0008, 250000=0.0008, 500000=0.0007, 1500000=0.0007 (USD); Case/Package: 0402; Contact Plating: Tin,Matte; Case Code (Metric): 1005; Case Code (Imperial): 0402; Size Code: 0402; Min Operating Temperature: -55°C; Max Operating Temperature: 155°C; Packaging: Tape and Reel; Resistor Type: Thick Film; Number of Terminations: 2; Termination: SMD/SMT; Features: Moisture Resistant; Series: RC; Package Quantity: 1; Technology: THICK FILM; Resistance Tolerance: 5%; Construction: Rectangular; Length: 1mm; Width: 0.02inch; Height: 0.016inch; Depth: 0.5mm; Lead Free: 5697LeadFree; Reach SVHC Compliant: Unknown; RoHS Compliant: Yes; Military Standard: Not; Supplier Part Number 1: 3375797
R502 = RC0201FR-072K2L: SMD Chip Resistor, 2.2 kOhm, ± 1%, 50 mW, 0201 [0603 Metric], Thick Film, General Purpose; Manufacturer: Yageo; Supplier 1: Future Electronics; Manufacturer Part Number: RC0201FR-072K2L; RoHS: Yes; Category: Chip SMD Resistors; Stock 1: 2030000; Pricing 1: 10000=0.0008, 50000=0.0008, 300000=0.0007, 1000000=0.0007, 3000000=0.0006 (USD); ComponentLink1URL: https://datasheet.ciiva.com/7672/1563626-7672218.pdf?src-supplier=Element14; ComponentLink1Description: https://datasheet.ciiva.com/7672/1563626-7672218.pdf?src-supplier=Element14; Supplier Part Number 1: 3937737
R503 R504 = RC0201JR-070RL: Zero Ohm Resistor, Jumper, 0201 [0603 Metric], Thick Film, 50 mW, 500 mA, Surface Mount; Manufacturer: Yageo; Power Rating: 50mW; Tolerance: 5%; Voltage Rating: 25V; Temperature Coefficient: 200ppm/°C; Supplier 1: Future Electronics; Manufacturer Part Number: RC0201JR-070RL; RoHS: Yes; Category: Chip SMD Resistors; Stock 1: 7600000; Pricing 1: 10000=0.0009, 50000=0.0009, 250000=0.0008, 500000=0.0008, 1500000=0.0007 (USD); Case/Package: 0201; Contact Plating: Tin,Matte; Case Code (Metric): 0603; Case Code (Imperial): 0201; Weight: 6E-06oz; Size Code: 0201; Min Operating Temperature: -55°C; Max Operating Temperature: 125°C; Resistor Type: Thick Film; Packaging: Tape and Reel; Resistance: 0R; Package Quantity: 1; Series: RC; Number of Terminations: 2; Termination: SMD/SMT; Max Power Dissipation: 50mW; Voltage Rating (DC): 25V; Features: Moisture Resistant; Resistance Tolerance: 5%; Length: 0.024inch; Width: 0.012inch; Height: 0.01inch; RoHS Compliant: Yes; Lead Free: Lead Free; Reach SVHC Compliant: Unknown; ComponentLink1URL: https://datasheet.ciiva.com/7672/1563626-7672248.pdf?src-supplier=Element14; ComponentLink1Description: https://datasheet.ciiva.com/7672/1563626-7672248.pdf?src-supplier=Element14; ComponentLink2URL: https://datasheet.ciiva.com/7660/1421516-7660808.pdf?src-supplier=Element14; ComponentLink2Description: https://datasheet.ciiva.com/7660/1421516-7660808.pdf?src-supplier=Element14; ComponentLink3URL: https://datasheet.ciiva.com/8896/pyu-rc0201-51-rohs-l-8-8896143.pdf?src-supplier=Avnet; ComponentLink3Description: https://datasheet.ciiva.com/8896/pyu-rc0201-51-rohs-l-8-8896143.pdf?src-supplier=Avnet; ComponentLink4URL: https://datasheet.ciiva.com/7672/1563626-7672247.pdf?src-supplier=Element14; ComponentLink4Description: https://datasheet.ciiva.com/7672/1563626-7672247.pdf?src-supplier=Element14; ComponentLink5URL: https://datasheet.ciiva.com/46391/1421516-46391340.pdf?src-supplier=Element14; ComponentLink5Description: https://datasheet.ciiva.com/46391/1421516-46391340.pdf?src-supplier=Element14; Supplier Part Number 1: 9983388
R505 = RC0201FR-072K49L: SMD Chip Resistor, 2.49 kOhm, ± 1%, 50 mW, 0201 [0603 Metric], Thick Film, General Purpose; Manufacturer: Yageo; Voltage Rating: 25V; Supplier 1: Arrow Electronics; Manufacturer Part Number: RC0201FR-072K49L; RoHS: Yes; Category: Chip SMD Resistors; Stock 1: 23075; Pricing 1: 1=0.091, 10=0.0127, 25=0.0126, 100=0.0073, 250=0.007, 500=0.0069, 1000=0.0036, 3000=0.0034, 6000=0.0031, 15000=0.0019 (USD); ComponentLink1URL: https://datasheet.ciiva.com/14985/pyu-r-int-thick-7-14985453.pdf?src-supplier=Digikey; ComponentLink1Description: https://datasheet.ciiva.com/14985/pyu-r-int-thick-7-14985453.pdf?src-supplier=Digikey; Supplier Part Number 1: RC0201FR-072K49L
R507 R508 = RC0402FR-071KL: SMD Chip Resistor, 1 kOhm, ± 1%, 63 mW, 0402 [1005 Metric], Thick Film, General Purpose; Manufacturer: Yageo; Resistance: 1kR; Temperature Coefficient: 100ppm/°C; Voltage Rating (DC): 50V; Power Rating: 62.5mW; Max Power Dissipation: 63mW; Supplier 1: Future Electronics; Manufacturer Part Number: RC0402FR-071KL; RoHS: Yes; Category: Chip SMD Resistors; Stock 1: 37960000; Pricing 1: 10000=0.0008, 50000=0.0008, 250000=0.0007, 500000=0.0007, 1500000=0.0007 (USD); Case/Package: 0402; Number of Pins: 2; Case Code (Imperial): 0402; Case Code (Metric): 1005; Size Code: 0402; Min Operating Temperature: -55°C; Max Operating Temperature: 155°C; Resistor Type: Thick Film; Tolerance: 1%; Packaging: Tape and Reel; Voltage Rating: 50V; Termination: SMD/SMT; Features: Moisture Resistant; Series: RC; Number of Terminations: 2; Resistance Tolerance: 1%; Construction: Rectangular; Technology: THICK FILM; Voltage Rating (AC): 50V; Length: 1mm; Width: 0.5mm; Height: 0.32mm; Depth: 0.5mm; Reach SVHC Compliant: No; RoHS Compliant: Yes; Military Standard: Not; ComponentLink1URL: https://datasheet.ciiva.com/11819/0900766b80c66297-11819477.pdf?src-supplier=Rs; ComponentLink1Description: https://datasheet.ciiva.com/11819/0900766b80c66297-11819477.pdf?src-supplier=Rs; ComponentLink2URL: https://datasheet.ciiva.com/7983/1018594-7983502.pdf?src-supplier=Element14; ComponentLink2Description: https://datasheet.ciiva.com/7983/1018594-7983502.pdf?src-supplier=Element14; ComponentLink3URL: https://datasheet.ciiva.com/22747/1018594-22747513.pdf?src-supplier=Element14; ComponentLink3Description: https://datasheet.ciiva.com/22747/1018594-22747513.pdf?src-supplier=Element14; ComponentLink4URL: https://datasheet.ciiva.com/12666/pyu-rc0402-51-rohs-l-6-r-12666741.pdf?src-supplier=Mouser; ComponentLink4Description: https://datasheet.ciiva.com/12666/pyu-rc0402-51-rohs-l-6-r-12666741.pdf?src-supplier=Mouser; ComponentLink5URL: https://datasheet.ciiva.com/7849/1018594-7849869.pdf?src-supplier=Element14; ComponentLink5Description: https://datasheet.ciiva.com/7849/1018594-7849869.pdf?src-supplier=Element14; ComponentLink6URL: https://datasheet.ciiva.com/7849/1018594-7849871.pdf?src-supplier=Element14; ComponentLink6Description: https://datasheet.ciiva.com/7849/1018594-7849871.pdf?src-supplier=Element14; ComponentLink7URL: https://datasheet.ciiva.com/17063/pyu-rc0402-51-rohs-l-6-r-17063193.pdf?src-supplier=Future+Electronics; ComponentLink7Description: https://datasheet.ciiva.com/17063/pyu-rc0402-51-rohs-l-6-r-17063193.pdf?src-supplier=Future+Electronics; Supplier Part Number 1: 7825607
R509 = RC1206FR-071ML: SMD Chip Resistor, 1 MOhm, ± 1%, 250 mW, 1206 [3216 Metric], Thick Film, General Purpose; Manufacturer: Yageo; Resistance: 1MR; Temperature Coefficient: 100ppm/°C; Power Rating: 250mW; Voltage Rating: 200V; Supplier 1: Future Electronics; Manufacturer Part Number: RC1206FR-071ML; RoHS: Yes; Category: Chip SMD Resistors; Stock 1: 9835000; Pricing 1: 5000=0.0036, 20000=0.0034, 75000=0.0033, 200000=0.0031, 500000=0.0029 (USD); Case/Package: 1206; Case Code (Imperial): 1206; Case Code (Metric): 3216; Size Code: 1206; Min Operating Temperature: -55°C; Max Operating Temperature: 155°C; Tolerance: 1%; Packaging: Tape and Reel; Resistor Type: Thick Film; Package Quantity: 5000; Termination: SMD/SMT; Features: Moisture Resistant; Series: RC; Max Power Dissipation: 250mW; Number of Terminations: 2; Technology: THICK FILM; Resistance Tolerance: 1%; Voltage Rating (AC): 200V; Length: 3.1mm; Width: 1.6mm; Height: 0.55mm; Depth: 1.6mm; Reach SVHC Compliant: Unknown; Lead Free: 5697LeadFree; RoHS Compliant: Yes; ComponentLink1URL: https://datasheet.ciiva.com/11819/0900766b80c6630a-11819912.pdf?src-supplier=Rs; ComponentLink1Description: https://datasheet.ciiva.com/11819/0900766b80c6630a-11819912.pdf?src-supplier=Rs; ComponentLink2URL: https://datasheet.ciiva.com/46445/444357-46445709.pdf?src-supplier=Element14; ComponentLink2Description: https://datasheet.ciiva.com/46445/444357-46445709.pdf?src-supplier=Element14; ComponentLink3URL: https://datasheet.ciiva.com/7857/444357-7857289.pdf?src-supplier=Element14; ComponentLink3Description: https://datasheet.ciiva.com/7857/444357-7857289.pdf?src-supplier=Element14; ComponentLink4URL: https://datasheet.ciiva.com/7857/444357-7857288.pdf?src-supplier=Element14; ComponentLink4Description: https://datasheet.ciiva.com/7857/444357-7857288.pdf?src-supplier=Element14; ComponentLink5URL: https://datasheet.ciiva.com/17033/pyu-rc1206-51-rohs-l-4-17033611.pdf?src-supplier=Future+Electronics; ComponentLink5Description: https://datasheet.ciiva.com/17033/pyu-rc1206-51-rohs-l-4-17033611.pdf?src-supplier=Future+Electronics; Supplier Part Number 1: 3640612
R510-R519 R522 R523 R526-R531 = RC0201JR-074K7L: SMD Chip Resistor, 4.7 kOhm, ± 5%, 50 mW, 0201 [0603 Metric], Thick Film, General Purpose; Manufacturer: Yageo; Supplier 1: Future Electronics; Manufacturer Part Number: RC0201JR-074K7L; RoHS: Yes; Category: Chip SMD Resistors; Stock 1: 3730000; Pricing 1: 10000=0.0012, 50000=0.0011, 200000=0.0011, 500000=0.001, 1250000=0.001 (USD); ComponentLink1URL: https://datasheet.ciiva.com/2462/pyu-r-int-thick-7-2462790.pdf?src-supplier=Digi-Key; ComponentLink1Description: https://datasheet.ciiva.com/2462/pyu-r-int-thick-7-2462790.pdf?src-supplier=Digi-Key; ComponentLink2URL: https://datasheet.ciiva.com/2462/pyu-r-int-thick-7-2462791.pdf?src-supplier=Digi-Key; ComponentLink2Description: https://datasheet.ciiva.com/2462/pyu-r-int-thick-7-2462791.pdf?src-supplier=Digi-Key; ComponentLink3URL: https://datasheet.ciiva.com/2462/pyu-r-int-thick-7-2462792.pdf?src-supplier=Digi-Key; ComponentLink3Description: https://datasheet.ciiva.com/2462/pyu-r-int-thick-7-2462792.pdf?src-supplier=Digi-Key; ComponentLink4URL: https://datasheet.ciiva.com/7672/1563626-7672295.pdf?src-supplier=Element14; ComponentLink4Description: https://datasheet.ciiva.com/7672/1563626-7672295.pdf?src-supplier=Element14; ComponentLink5URL: https://datasheet.ciiva.com/7672/1563626-7672296.pdf?src-supplier=Element14; ComponentLink5Description: https://datasheet.ciiva.com/7672/1563626-7672296.pdf?src-supplier=Element14; Supplier Part Number 1: 7808587
R520 R521 R524 R525 = RC0201FR-0710KL: SMD Chip Resistor, 10 kOhm, ± 1%, 50 mW, 0201 [0603 Metric], Thick Film, General Purpose; Manufacturer: Yageo; Resistance: 10kR; Temperature Coefficient: 200ppm/°C; Power Rating: 50mW; Voltage Rating: 25V; Supplier 1: Future Electronics; Manufacturer Part Number: RC0201FR-0710KL; RoHS: Yes; Category: Chip SMD Resistors; Stock 1: 32510000; Pricing 1: 10000=0.0014, 40000=0.0013, 200000=0.0013, 400000=0.0012, 1250000=0.0011 (USD); Case/Package: 0201; Contact Plating: Tin,Matte; Case Code (Imperial): 0201; Case Code (Metric): 0603; Weight: 6E-06oz; Min Operating Temperature: -55°C; Max Operating Temperature: 125°C; Tolerance: 1%; Packaging: Tape and Reel; Package Quantity: 10000; Termination: SMD/SMT; Resistor Type: Thick Film; Series: RC; Number of Terminations: 2; Max Power Dissipation: 50mW; Working Voltage: 25V; Features: Moisture Resistant; Technology: THICK FILM; Resistance Tolerance: 1%; Construction: Rectangular; Voltage Rating (DC): 25V; Length: 0.6mm; Width: 0.012inch; Height: 0.01inch; Depth: 0.3mm; RoHS Compliant: Yes; Reach SVHC Compliant: No; Military Standard: Not; ComponentLink1URL: https://datasheet.ciiva.com/7660/1421516-7660807.pdf?src-supplier=Element14; ComponentLink1Description: https://datasheet.ciiva.com/7660/1421516-7660807.pdf?src-supplier=Element14; ComponentLink2URL: https://datasheet.ciiva.com/46391/1421516-46391339.pdf?src-supplier=Element14; ComponentLink2Description: https://datasheet.ciiva.com/46391/1421516-46391339.pdf?src-supplier=Element14; ComponentLink3URL: https://datasheet.ciiva.com/2467/pyu-r-int-thick-7-2467110.pdf?src-supplier=Digi-Key; ComponentLink3Description: https://datasheet.ciiva.com/2467/pyu-r-int-thick-7-2467110.pdf?src-supplier=Digi-Key; ComponentLink4URL: https://datasheet.ciiva.com/2467/pyu-r-int-thick-7-2467111.pdf?src-supplier=Digi-Key; ComponentLink4Description: https://datasheet.ciiva.com/2467/pyu-r-int-thick-7-2467111.pdf?src-supplier=Digi-Key; ComponentLink5URL: https://datasheet.ciiva.com/2467/pyu-r-int-thick-7-2467109.pdf?src-supplier=Digi-Key; ComponentLink5Description: https://datasheet.ciiva.com/2467/pyu-r-int-thick-7-2467109.pdf?src-supplier=Digi-Key; ComponentLink6URL: https://datasheet.ciiva.com/26829/getdatasheetpartid-421074-26829851.pdf?src-supplier=Verical; ComponentLink6Description: https://datasheet.ciiva.com/26829/getdatasheetpartid-421074-26829851.pdf?src-supplier=Verical; ComponentLink7URL: https://datasheet.ciiva.com/8891/pyu-rc0201-51-rohs-l-8-8891384.pdf?src-supplier=Avnet; ComponentLink7Description: https://datasheet.ciiva.com/8891/pyu-rc0201-51-rohs-l-8-8891384.pdf?src-supplier=Avnet; Supplier Part Number 1: 4031233
TP501 = Test Point: Solder: NF
U501 = RTL8211: IC, Interface, Ethernet, RTL8211F-VD-CG, QFN-40(5*5); Part Reference: U6; Manufacturer: Realtek; Company Part Status: BeagleV-Ahead; PN: 310991199; PCB Footprint: qfn40_0D4_5x5mm; Manufacturer PN: RTL8211F-VD-CG; CLASS: IC
Y501 = LFXTAL055299: Crystal, 25MHZ, 18PF, SMD; Manufacturer: IQD; Supplier 1: Digi-Key; Manufacturer Part Number: LFXTAL055299; RoHS: Yes; Stock 1: 46105; Pricing 1: 1=0.75, 10=0.66, 50=0.6168, 100=0.545, 500=0.51632, 1000=0.43026 (USD); ComponentLink1URL: https://datasheet.ciiva.com/46419/1853066-46419804.pdf?src-supplier=Element14; ComponentLink1Description: https://datasheet.ciiva.com/46419/1853066-46419804.pdf?src-supplier=Element14; Supplier Part Number 1: 1923-LFXTAL055299CT-ND